# EAGLE board sensor_003 (EAGLE 7.3.0), part 1 of 2
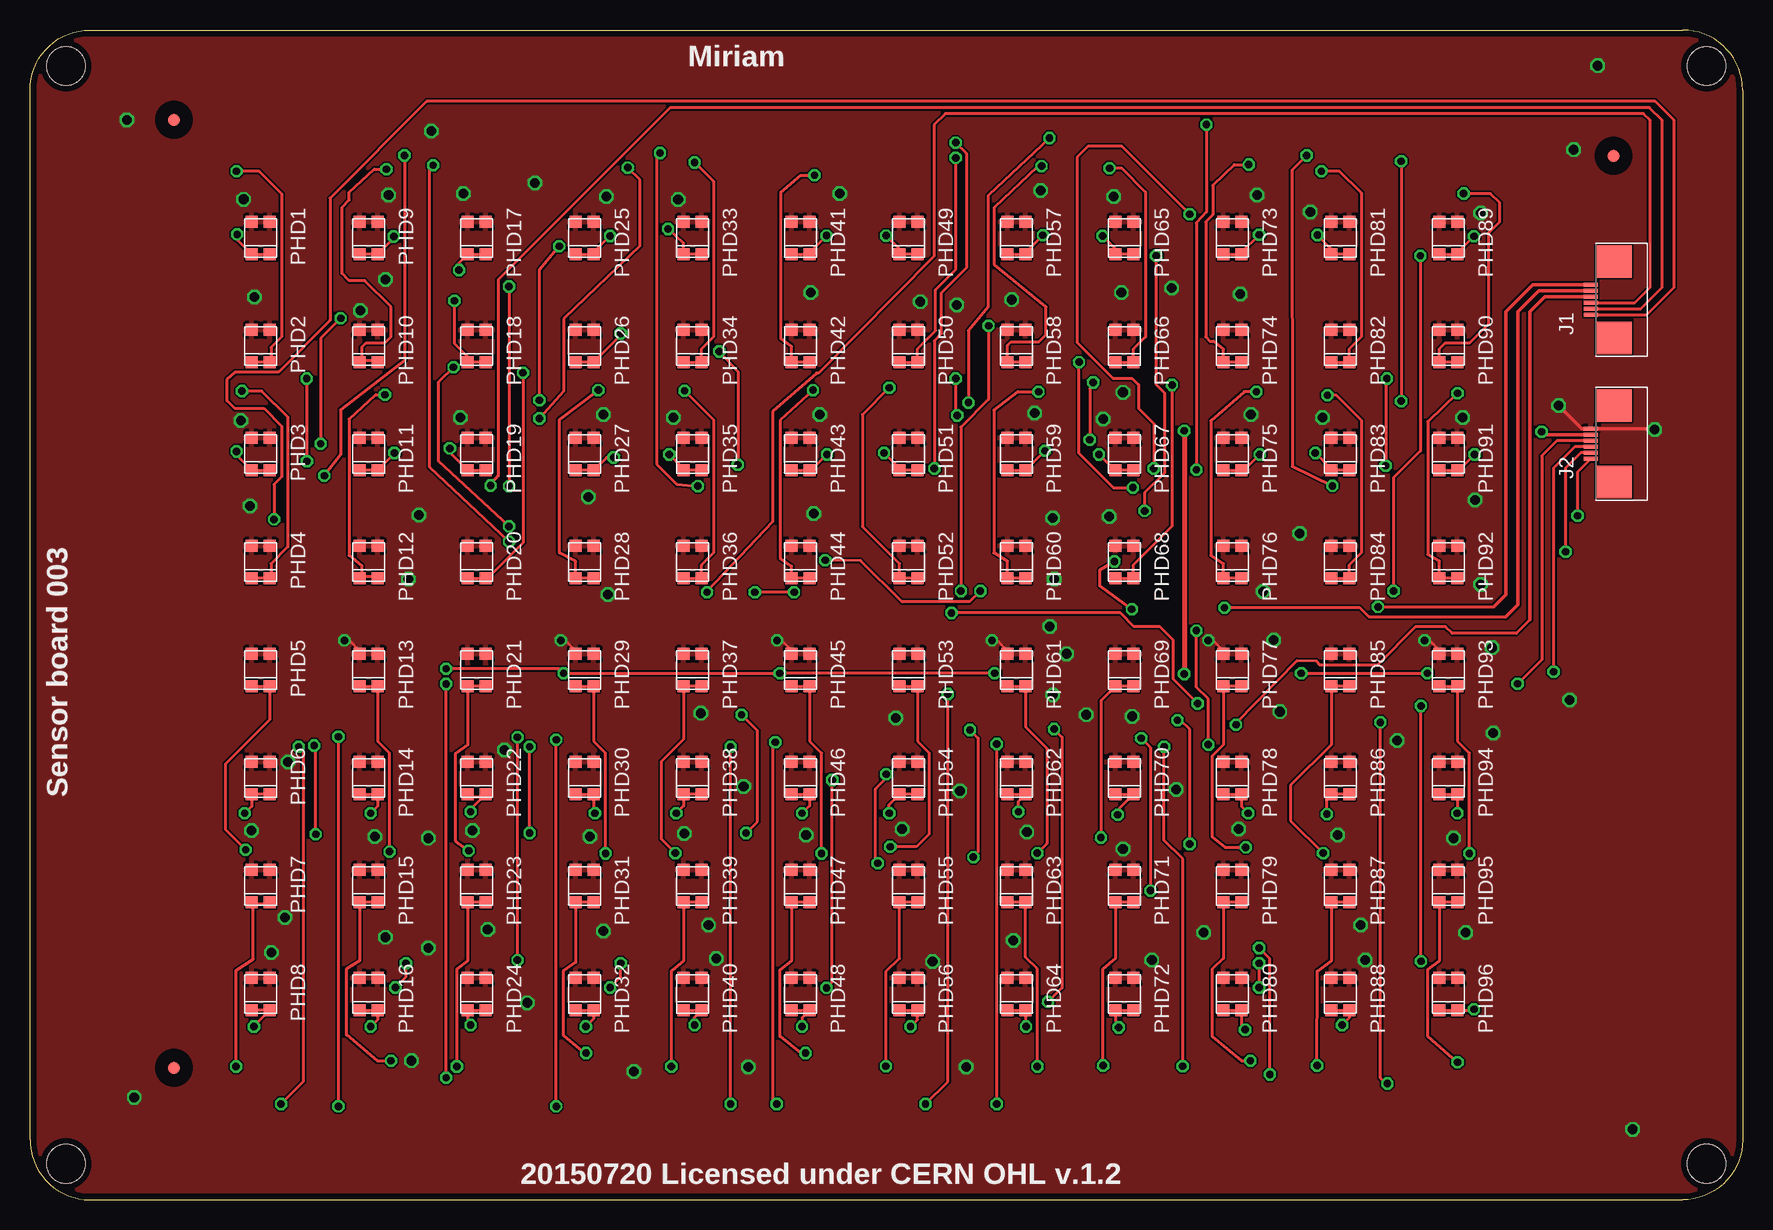
[diagram p5: board, top side]
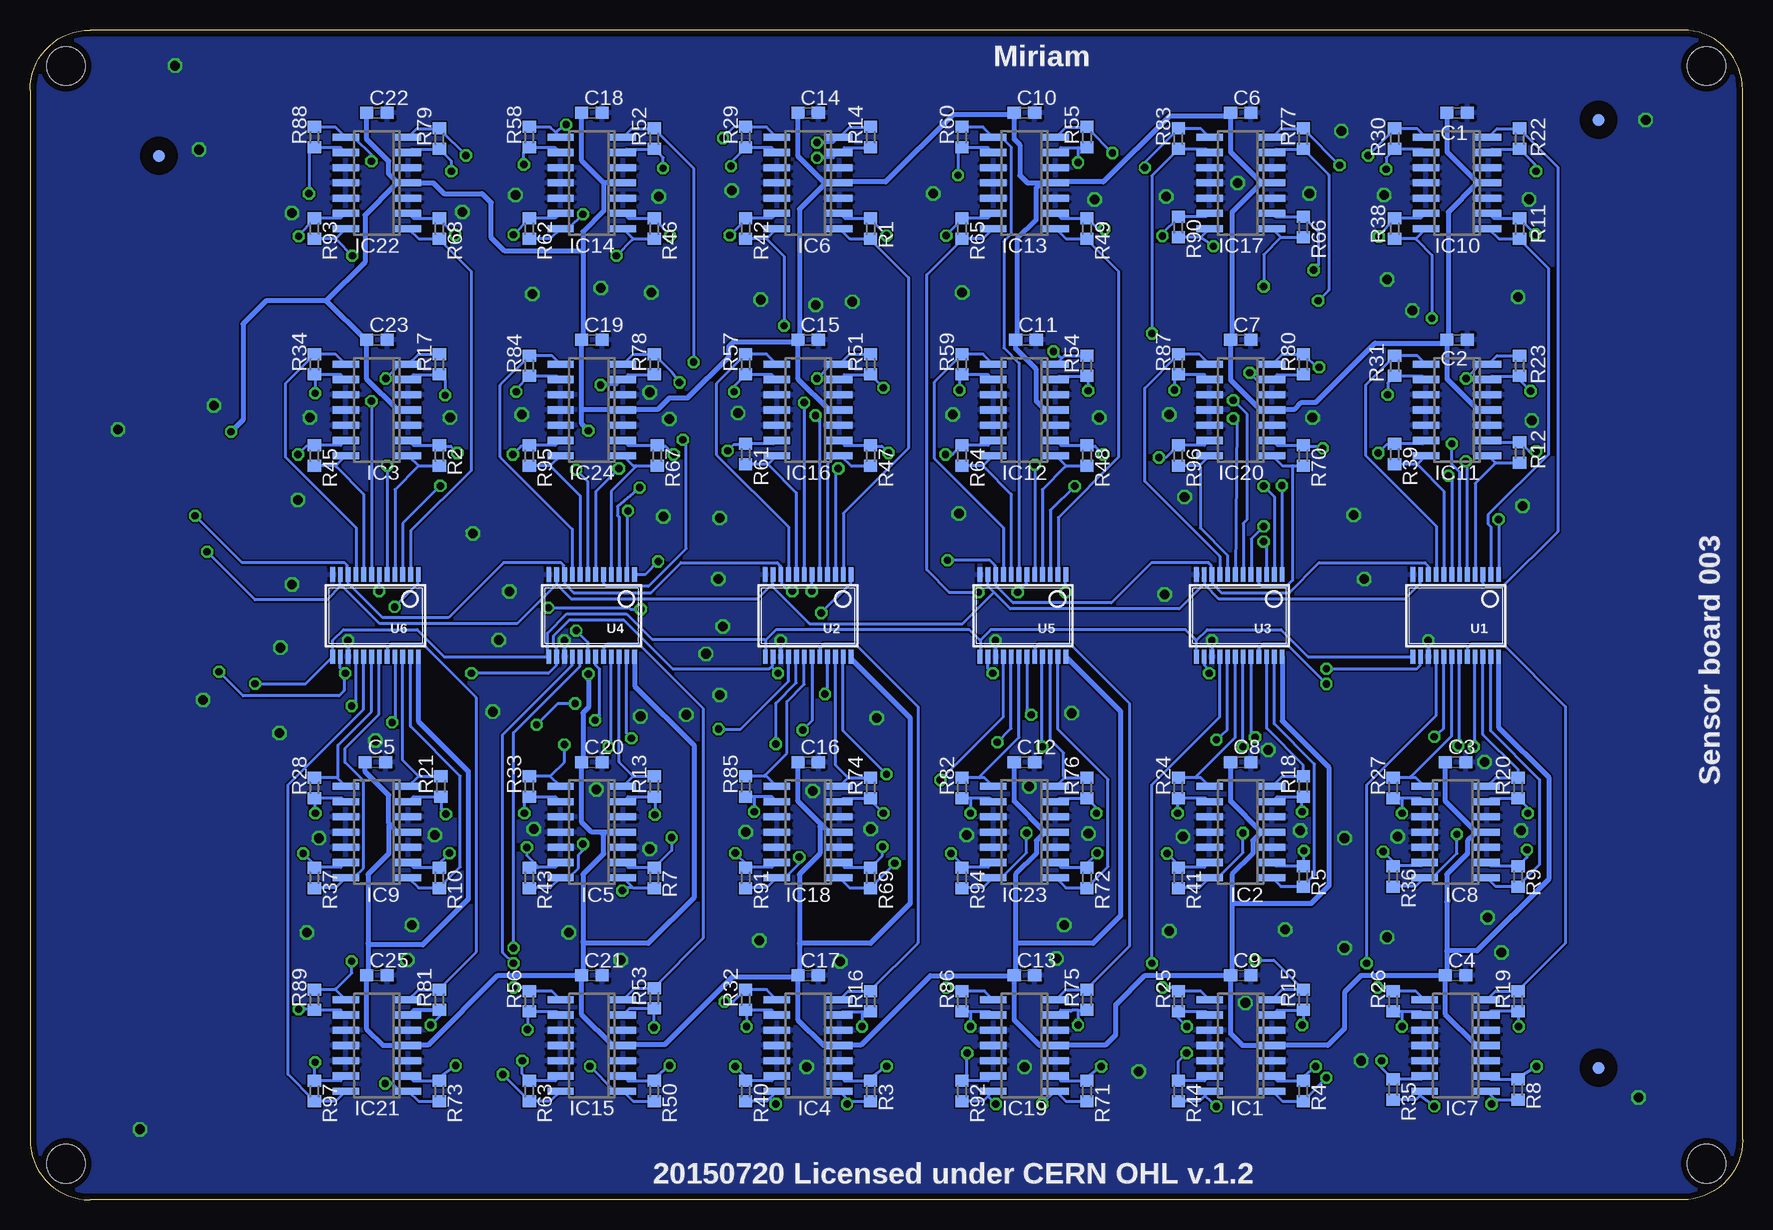
[diagram p6: board, bottom side, seen from below]

Size 142.76 x 97.48 mm. Coordinates in mm from the lower left corner, seen from the top.
Outline: 0,87.91 arc0 0,87.91
Outline: 5,0 137.76,0 arc90 142.76,5 142.76,92.48 arc90 137.76,97.48 5,97.48 arc90 0,92.48 0,5 arc90 5,0
Copper layers (1*16): Top 0.035mm / dielectric 1.5mm / Bottom 0.035mm
Design rules "default *": minimum track width 9mil, minimum drill 24mil, track to track 6mil, track to pad 6mil, pad to pad 6mil, via to via 6mil, smd to smd 6mil, copper to edge 20mil, drill to drill 8mil, minimum pad ring 10mil, minimum via ring 8mil, stop-mask expansion 4mil, vias tented up to drill 0mil, thermal gap 10mil
Net classes: 0 default: width 0.254 mm, drill 0.406 mm, clearance 0.127 mm; 1 power: width 0.406 mm, drill 0.406 mm, clearance 0.305 mm; 2 gnd: width 0.254 mm, drill 0.406 mm, clearance 0.254 mm; 3 power usb: width 0.254 mm, drill 0.406 mm, clearance 0.254 mm; 4 power12: width 1.778 mm, drill 0.889 mm, clearance 0.254 mm
Holes 3.2 mm at 3,94.48 139.76,94.48 139.76,3 3,3

## Footprints (pad centres in the part's own frame; a part is rotated, then mirrored left to right if it is on the bottom)
C0603 = smd 1.1 x 1: 1 -0.85,0; 2 0.85,0
FIDUCIA-MOUNT = smd 1.016 x 1.016: P$1 0,0
SO14 = smd 0.6 x 2.2: 1 -3.81,-2.6; 2 -2.54,-2.6; 3 -1.27,-2.6; 4 0,-2.6; 5 1.27,-2.6; 6 2.54,-2.6; 7 3.81,-2.6; 8 3.81,2.6; 9 2.54,2.6; 10 1.27,2.6; 11 0,2.6; 12 -1.27,2.6; 13 -2.54,2.6; 14 -3.81,2.6
68710614522 = smd 0.3 x 1.2: 1 -1.25,1.9; 2 -0.75,1.9; 3 -0.25,1.9; 4 0.25,1.9; 5 0.75,1.9; 6 1.25,1.9 | smd 2.7 x 3: Z1 -3.18,0; Z2 3.18,0
PD_0.2 = smd 1 x 1: 1 -1.25,0.6; 2 -1.25,-0.9; 3 1.45,0.6; 4 1.45,-0.9
R0603 = smd 1 x 1.1: 1 -0.85,0; 2 0.85,0
SSOP24 = smd 0.4 x 1.2: 1 -3.575,-3.42; 2 -2.925,-3.42; 3 -2.275,-3.42; 4 -1.625,-3.42; 5 -0.975,-3.42; 6 -0.325,-3.42; 7 0.325,-3.42; 8 0.975,-3.42; 9 1.625,-3.42; 10 2.275,-3.42; 11 2.925,-3.42; 12 3.575,-3.42; 13 3.575,3.42; 14 2.925,3.42; 15 2.275,3.42; 16 1.625,3.42; 17 0.975,3.42; 18 0.325,3.42; 19 -0.325,3.42; 20 -0.975,3.42; 21 -1.625,3.42; 22 -2.275,3.42; 23 -2.925,3.42; 24 -3.575,3.42

## Placement (x,y rotation side)
C1  100nF  [C0603]  23.8,90.58 0 bottom
C2  100nF  [C0603]  23.8,71.66 0 bottom
C3  100nF  [C0603]  23.92,36.48 0 bottom
C4  100nF  [C0603]  23.92,18.7 0 bottom
C5  100nF  [C0603]  113.97,36.48 0 bottom
C6  100nF  [C0603]  41.83,90.58 0 bottom
C7  100nF  [C0603]  41.83,71.66 0 bottom
C8  100nF  [C0603]  41.83,36.48 0 bottom
C9  100nF  [C0603]  41.83,18.7 0 bottom
C10  100nF  [C0603]  59.86,90.58 0 bottom
C11  100nF  [C0603]  59.74,71.66 0 bottom
C12  100nF  [C0603]  59.86,36.48 0 bottom
C13  100nF  [C0603]  59.86,18.7 0 bottom
C14  100nF  [C0603]  77.9,90.58 0 bottom
C15  100nF  [C0603]  77.9,71.66 0 bottom
C16  100nF  [C0603]  77.9,36.48 0 bottom
C17  100nF  [C0603]  77.9,18.7 0 bottom
C18  100nF  [C0603]  95.93,90.58 0 bottom
C19  100nF  [C0603]  95.93,71.66 0 bottom
C20  100nF  [C0603]  95.93,36.48 0 bottom
C21  100nF  [C0603]  95.93,18.7 0 bottom
C22  100nF  [C0603]  113.84,90.58 0 bottom
C23  100nF  [C0603]  113.84,71.66 0 bottom
C25  100nF  [C0603]  113.84,18.7 0 bottom
FD1  FIDUCIALMOUNT  [FIDUCIA-MOUNT]  12,90 0 top
FD2  FIDUCIALMOUNT  [FIDUCIA-MOUNT]  12,11 0 top
FD3  FIDUCIALMOUNT  [FIDUCIA-MOUNT]  132,87 0 top
FD4  FIDUCIALMOUNT  [FIDUCIA-MOUNT]  12,90 0 bottom
FD5  FIDUCIALMOUNT  [FIDUCIA-MOUNT]  12,11 0 bottom
FD6  FIDUCIALMOUNT  [FIDUCIA-MOUNT]  132,87 0 bottom
IC1  LMV324  [SO14]  41.83,12.86 90 bottom
IC2  LMV324  [SO14]  41.83,30.64 90 bottom
IC3  LMV324  [SO14]  113.84,65.82 90 bottom
IC4  LMV324  [SO14]  77.9,12.86 90 bottom
IC5  LMV324  [SO14]  95.93,30.64 90 bottom
IC6  LMV324  [SO14]  77.9,84.74 90 bottom
IC7  LMV324  [SO14]  23.92,12.86 90 bottom
IC8  LMV324  [SO14]  23.92,30.64 90 bottom
IC9  LMV324  [SO14]  113.84,30.64 90 bottom
IC10  LMV324  [SO14]  23.8,84.74 90 bottom
IC11  LMV324  [SO14]  23.8,65.82 90 bottom
IC12  LMV324  [SO14]  59.86,65.82 90 bottom
IC13  LMV324  [SO14]  59.86,84.74 90 bottom
IC14  LMV324  [SO14]  95.93,84.74 90 bottom
IC15  LMV324  [SO14]  95.93,12.86 90 bottom
IC16  LMV324  [SO14]  77.9,65.82 90 bottom
IC17  LMV324  [SO14]  41.83,84.74 90 bottom
IC18  LMV324  [SO14]  77.9,30.64 90 bottom
IC19  LMV324  [SO14]  59.86,12.86 90 bottom
IC20  LMV324  [SO14]  41.83,65.82 90 bottom
IC21  LMV324  [SO14]  113.84,12.86 90 bottom
IC22  LMV324  [SO14]  113.84,84.74 90 bottom
IC23  LMV324  [SO14]  59.86,30.64 90 bottom
IC24  LMV324  [SO14]  95.93,65.82 90 bottom
J1  [68710614522]  132,75 90 top
J2  [68710614522]  132,63 90 top
PHD1  CLS15-22C/L213G/TR8  [PD_0.2]  19.38,80.24 270 top
PHD2  CLS15-22C/L213G/TR8  [PD_0.2]  19.38,71.24 270 top
PHD3  CLS15-22C/L213G/TR8  [PD_0.2]  19.38,62.24 270 top
PHD4  CLS15-22C/L213G/TR8  [PD_0.2]  19.38,53.24 270 top
PHD5  CLS15-22C/L213G/TR8  [PD_0.2]  19.38,44.24 270 top
PHD6  CLS15-22C/L213G/TR8  [PD_0.2]  19.38,35.24 270 top
PHD7  CLS15-22C/L213G/TR8  [PD_0.2]  19.38,26.24 270 top
PHD8  CLS15-22C/L213G/TR8  [PD_0.2]  19.38,17.24 270 top
PHD9  CLS15-22C/L213G/TR8  [PD_0.2]  28.38,80.24 270 top
PHD10  CLS15-22C/L213G/TR8  [PD_0.2]  28.38,71.24 270 top
PHD11  CLS15-22C/L213G/TR8  [PD_0.2]  28.38,62.24 270 top
PHD12  CLS15-22C/L213G/TR8  [PD_0.2]  28.38,53.24 270 top
PHD13  CLS15-22C/L213G/TR8  [PD_0.2]  28.38,44.24 270 top
PHD14  CLS15-22C/L213G/TR8  [PD_0.2]  28.38,35.24 270 top
PHD15  CLS15-22C/L213G/TR8  [PD_0.2]  28.38,26.24 270 top
PHD16  CLS15-22C/L213G/TR8  [PD_0.2]  28.38,17.24 270 top
PHD17  CLS15-22C/L213G/TR8  [PD_0.2]  37.38,80.24 270 top
PHD18  CLS15-22C/L213G/TR8  [PD_0.2]  37.38,71.24 270 top
PHD19  CLS15-22C/L213G/TR8  [PD_0.2]  37.38,62.24 270 top
PHD20  CLS15-22C/L213G/TR8  [PD_0.2]  37.38,53.24 270 top
PHD21  CLS15-22C/L213G/TR8  [PD_0.2]  37.38,44.24 270 top
PHD22  CLS15-22C/L213G/TR8  [PD_0.2]  37.38,35.24 270 top
PHD23  CLS15-22C/L213G/TR8  [PD_0.2]  37.38,26.24 270 top
PHD24  CLS15-22C/L213G/TR8  [PD_0.2]  37.38,17.24 270 top
PHD25  CLS15-22C/L213G/TR8  [PD_0.2]  46.38,80.24 270 top
PHD26  CLS15-22C/L213G/TR8  [PD_0.2]  46.38,71.24 270 top
PHD27  CLS15-22C/L213G/TR8  [PD_0.2]  46.38,62.24 270 top
PHD28  CLS15-22C/L213G/TR8  [PD_0.2]  46.38,53.24 270 top
PHD29  CLS15-22C/L213G/TR8  [PD_0.2]  46.38,44.24 270 top
PHD30  CLS15-22C/L213G/TR8  [PD_0.2]  46.38,35.24 270 top
PHD31  CLS15-22C/L213G/TR8  [PD_0.2]  46.38,26.24 270 top
PHD32  CLS15-22C/L213G/TR8  [PD_0.2]  46.38,17.24 270 top
PHD33  CLS15-22C/L213G/TR8  [PD_0.2]  55.38,80.24 270 top
PHD34  CLS15-22C/L213G/TR8  [PD_0.2]  55.38,71.24 270 top
PHD35  CLS15-22C/L213G/TR8  [PD_0.2]  55.38,62.24 270 top
PHD36  CLS15-22C/L213G/TR8  [PD_0.2]  55.38,53.24 270 top
PHD37  CLS15-22C/L213G/TR8  [PD_0.2]  55.38,44.24 270 top
PHD38  CLS15-22C/L213G/TR8  [PD_0.2]  55.38,35.24 270 top
PHD39  CLS15-22C/L213G/TR8  [PD_0.2]  55.38,26.24 270 top
PHD40  CLS15-22C/L213G/TR8  [PD_0.2]  55.38,17.24 270 top
PHD41  CLS15-22C/L213G/TR8  [PD_0.2]  64.38,80.24 270 top
PHD42  CLS15-22C/L213G/TR8  [PD_0.2]  64.38,71.24 270 top
PHD43  CLS15-22C/L213G/TR8  [PD_0.2]  64.38,62.24 270 top
PHD44  CLS15-22C/L213G/TR8  [PD_0.2]  64.38,53.24 270 top
PHD45  CLS15-22C/L213G/TR8  [PD_0.2]  64.38,44.24 270 top
PHD46  CLS15-22C/L213G/TR8  [PD_0.2]  64.38,35.24 270 top
PHD47  CLS15-22C/L213G/TR8  [PD_0.2]  64.38,26.24 270 top
PHD48  CLS15-22C/L213G/TR8  [PD_0.2]  64.38,17.24 270 top
PHD49  CLS15-22C/L213G/TR8  [PD_0.2]  73.38,80.24 270 top
PHD50  CLS15-22C/L213G/TR8  [PD_0.2]  73.38,71.24 270 top
PHD51  CLS15-22C/L213G/TR8  [PD_0.2]  73.38,62.24 270 top
PHD52  CLS15-22C/L213G/TR8  [PD_0.2]  73.38,53.24 270 top
PHD53  CLS15-22C/L213G/TR8  [PD_0.2]  73.38,44.24 270 top
PHD54  CLS15-22C/L213G/TR8  [PD_0.2]  73.38,35.24 270 top
PHD55  CLS15-22C/L213G/TR8  [PD_0.2]  73.38,26.24 270 top
PHD56  CLS15-22C/L213G/TR8  [PD_0.2]  73.38,17.24 270 top
PHD57  CLS15-22C/L213G/TR8  [PD_0.2]  82.38,80.24 270 top
PHD58  CLS15-22C/L213G/TR8  [PD_0.2]  82.38,71.24 270 top
PHD59  CLS15-22C/L213G/TR8  [PD_0.2]  82.38,62.24 270 top
PHD60  CLS15-22C/L213G/TR8  [PD_0.2]  82.38,53.24 270 top
PHD61  CLS15-22C/L213G/TR8  [PD_0.2]  82.38,44.24 270 top
PHD62  CLS15-22C/L213G/TR8  [PD_0.2]  82.38,35.24 270 top
PHD63  CLS15-22C/L213G/TR8  [PD_0.2]  82.38,26.24 270 top
PHD64  CLS15-22C/L213G/TR8  [PD_0.2]  82.38,17.24 270 top
PHD65  CLS15-22C/L213G/TR8  [PD_0.2]  91.38,80.24 270 top
PHD66  CLS15-22C/L213G/TR8  [PD_0.2]  91.38,71.24 270 top
PHD67  CLS15-22C/L213G/TR8  [PD_0.2]  91.38,62.24 270 top
PHD68  CLS15-22C/L213G/TR8  [PD_0.2]  91.38,53.24 270 top
PHD69  CLS15-22C/L213G/TR8  [PD_0.2]  91.38,44.24 270 top
PHD70  CLS15-22C/L213G/TR8  [PD_0.2]  91.38,35.24 270 top
PHD71  CLS15-22C/L213G/TR8  [PD_0.2]  91.38,26.24 270 top
PHD72  CLS15-22C/L213G/TR8  [PD_0.2]  91.38,17.24 270 top
PHD73  CLS15-22C/L213G/TR8  [PD_0.2]  100.38,80.24 270 top
PHD74  CLS15-22C/L213G/TR8  [PD_0.2]  100.38,71.24 270 top
PHD75  CLS15-22C/L213G/TR8  [PD_0.2]  100.38,62.24 270 top
PHD76  CLS15-22C/L213G/TR8  [PD_0.2]  100.38,53.24 270 top
PHD77  CLS15-22C/L213G/TR8  [PD_0.2]  100.38,44.24 270 top
PHD78  CLS15-22C/L213G/TR8  [PD_0.2]  100.38,35.24 270 top
PHD79  CLS15-22C/L213G/TR8  [PD_0.2]  100.38,26.24 270 top
PHD80  CLS15-22C/L213G/TR8  [PD_0.2]  100.38,17.24 270 top
PHD81  CLS15-22C/L213G/TR8  [PD_0.2]  109.38,80.24 270 top
PHD82  CLS15-22C/L213G/TR8  [PD_0.2]  109.38,71.24 270 top
PHD83  CLS15-22C/L213G/TR8  [PD_0.2]  109.38,62.24 270 top
PHD84  CLS15-22C/L213G/TR8  [PD_0.2]  109.38,53.24 270 top
PHD85  CLS15-22C/L213G/TR8  [PD_0.2]  109.38,44.24 270 top
PHD86  CLS15-22C/L213G/TR8  [PD_0.2]  109.38,35.24 270 top
PHD87  CLS15-22C/L213G/TR8  [PD_0.2]  109.38,26.24 270 top
PHD88  CLS15-22C/L213G/TR8  [PD_0.2]  109.38,17.24 270 top
PHD89  CLS15-22C/L213G/TR8  [PD_0.2]  118.38,80.24 270 top
PHD90  CLS15-22C/L213G/TR8  [PD_0.2]  118.38,71.24 270 top
PHD91  CLS15-22C/L213G/TR8  [PD_0.2]  118.38,62.24 270 top
PHD92  CLS15-22C/L213G/TR8  [PD_0.2]  118.38,53.24 270 top
PHD93  CLS15-22C/L213G/TR8  [PD_0.2]  118.38,44.24 270 top
PHD94  CLS15-22C/L213G/TR8  [PD_0.2]  118.38,35.24 270 top
PHD95  CLS15-22C/L213G/TR8  [PD_0.2]  118.38,26.24 270 top
PHD96  CLS15-22C/L213G/TR8  [PD_0.2]  118.38,17.24 270 top
R1  3.9Mohm  [R0603]  72.69,80.93 270 bottom
R2  3.9Mohm  [R0603]  108.63,62.01 270 bottom
R3  3.9Mohm  [R0603]  72.69,9.05 270 bottom
R4  3.9Mohm  [R0603]  36.62,9.05 270 bottom
R5  3.9Mohm  [R0603]  36.62,26.95 270 bottom
R7  3.9Mohm  [R0603]  90.73,26.83 270 bottom
R8  3.9Mohm  [R0603]  18.72,9.18 270 bottom
R9  3.9Mohm  [R0603]  18.72,26.95 270 bottom
R10  3.9Mohm  [R0603]  108.63,26.83 270 bottom
R11  3.9Mohm  [R0603]  18.59,80.93 270 bottom
R12  3.9Mohm  [R0603]  18.59,62.26 270 bottom
R13  3.9Mohm  [R0603]  90.73,34.45 90 bottom
R14  3.9Mohm  [R0603]  72.69,88.55 90 bottom
R15  3.9Mohm  [R0603]  36.62,16.67 90 bottom
R16  3.9Mohm  [R0603]  72.69,16.54 90 bottom
R17  3.9Mohm  [R0603]  108.63,69.63 90 bottom
R18  3.9Mohm  [R0603]  36.62,34.45 90 bottom
R19  3.9Mohm  [R0603]  18.72,16.54 90 bottom
R20  3.9Mohm  [R0603]  18.72,34.32 90 bottom
R21  3.9Mohm  [R0603]  108.51,34.45 90 bottom
R22  3.9Mohm  [R0603]  18.59,88.42 90 bottom
R23  3.9Mohm  [R0603]  18.59,69.5 90 bottom
R24  3.9Mohm  [R0603]  47.04,34.32 90 bottom
R25  3.9Mohm  [R0603]  47.04,16.54 90 bottom
R26  3.9Mohm  [R0603]  29.13,16.54 90 bottom
R27  3.9Mohm  [R0603]  29.13,34.32 90 bottom
R28  3.9Mohm  [R0603]  119.05,34.32 90 bottom
R29  3.9Mohm  [R0603]  83.11,88.55 90 bottom
R30  3.9Mohm  [R0603]  29,88.42 90 bottom
R31  3.9Mohm  [R0603]  29,69.5 90 bottom
R32  3.9Mohm  [R0603]  83.11,16.67 90 bottom
R33  3.9Mohm  [R0603]  101.14,34.45 90 bottom
R34  3.9Mohm  [R0603]  119.05,69.63 90 bottom
R35  3.9Mohm  [R0603]  29.13,9.18 270 bottom
R36  3.9Mohm  [R0603]  29.13,26.95 270 bottom
R37  3.9Mohm  [R0603]  119.05,26.83 270 bottom
R38  3.9Mohm  [R0603]  29,80.93 270 bottom
R39  3.9Mohm  [R0603]  29,62.13 270 bottom
R40  3.9Mohm  [R0603]  83.11,9.05 270 bottom
R41  3.9Mohm  [R0603]  47.04,26.83 270 bottom
R42  3.9Mohm  [R0603]  83.11,80.93 270 bottom
R43  3.9Mohm  [R0603]  101.14,26.83 270 bottom
R44  3.9Mohm  [R0603]  47.04,9.05 270 bottom
R45  3.9Mohm  [R0603]  119.05,62.01 270 bottom
R46  3.9Mohm  [R0603]  90.73,80.93 270 bottom
R47  3.9Mohm  [R0603]  72.69,62.01 270 bottom
R48  3.9Mohm  [R0603]  54.66,62.01 270 bottom
R49  3.9Mohm  [R0603]  54.66,80.93 270 bottom
R50  3.9Mohm  [R0603]  90.73,9.05 270 bottom
R51  3.9Mohm  [R0603]  72.69,69.63 90 bottom
R52  3.9Mohm  [R0603]  90.73,88.42 90 bottom
R53  3.9Mohm  [R0603]  90.73,16.8 90 bottom
R54  3.9Mohm  [R0603]  54.66,69.5 90 bottom
R55  3.9Mohm  [R0603]  54.66,88.55 90 bottom
R56  3.9Mohm  [R0603]  101.14,16.54 90 bottom
R57  3.9Mohm  [R0603]  83.11,69.63 90 bottom
R58  3.9Mohm  [R0603]  101.14,88.55 90 bottom
R59  3.9Mohm  [R0603]  65.07,69.63 90 bottom
R60  3.9Mohm  [R0603]  65.07,88.55 90 bottom
R61  3.9Mohm  [R0603]  83.11,62.13 270 bottom
R62  3.9Mohm  [R0603]  101.14,80.93 270 bottom
R63  3.9Mohm  [R0603]  101.14,9.05 270 bottom
R64  3.9Mohm  [R0603]  65.07,62.01 270 bottom
R65  3.9Mohm  [R0603]  65.07,80.93 270 bottom
R66  3.9Mohm  [R0603]  36.62,81.06 270 bottom
R67  3.9Mohm  [R0603]  90.47,62.01 270 bottom
R68  3.9Mohm  [R0603]  108.63,80.93 270 bottom
R69  3.9Mohm  [R0603]  72.69,26.83 270 bottom
R70  3.9Mohm  [R0603]  36.62,62.01 270 bottom
R71  3.9Mohm  [R0603]  54.66,9.05 270 bottom
R72  3.9Mohm  [R0603]  54.66,26.83 270 bottom
R73  3.9Mohm  [R0603]  108.63,9.05 270 bottom
R74  3.9Mohm  [R0603]  72.69,34.32 90 bottom
R75  3.9Mohm  [R0603]  54.66,16.67 90 bottom
R76  3.9Mohm  [R0603]  54.66,34.32 90 bottom
R77  3.9Mohm  [R0603]  36.62,88.42 90 bottom
R78  3.9Mohm  [R0603]  90.73,69.63 90 bottom
R79  3.9Mohm  [R0603]  108.63,88.42 90 bottom
R80  3.9Mohm  [R0603]  36.62,69.63 90 bottom
R81  3.9Mohm  [R0603]  108.63,16.67 90 bottom
R82  3.9Mohm  [R0603]  65.07,34.32 90 bottom
R83  3.9Mohm  [R0603]  47.04,88.42 90 bottom
R84  3.9Mohm  [R0603]  101.14,69.5 90 bottom
R85  3.9Mohm  [R0603]  83.11,34.45 90 bottom
R86  3.9Mohm  [R0603]  65.07,16.54 90 bottom
R87  3.9Mohm  [R0603]  47.04,69.63 90 bottom
R88  3.9Mohm  [R0603]  119.05,88.55 90 bottom
R89  3.9Mohm  [R0603]  119.05,16.67 90 bottom
R90  3.9Mohm  [R0603]  47.04,81.06 270 bottom
R91  3.9Mohm  [R0603]  83.11,26.83 270 bottom
R92  3.9Mohm  [R0603]  65.07,9.05 270 bottom
R93  3.9Mohm  [R0603]  119.05,80.93 270 bottom
R94  3.9Mohm  [R0603]  65.07,26.83 270 bottom
R95  3.9Mohm  [R0603]  101.14,62.01 270 bottom
R96  3.9Mohm  [R0603]  47.04,62.01 270 bottom
R97  3.9Mohm  [R0603]  119.05,9.05 270 bottom
U1  74HC4067  [SSOP24]  23.92,48.67 180 bottom
U2  74HC4067  [SSOP24]  77.9,48.67 180 bottom
U3  74HC4067  [SSOP24]  41.96,48.67 180 bottom
U4  74HC4067  [SSOP24]  95.93,48.67 180 bottom
U5  74HC4067  [SSOP24]  59.99,48.67 180 bottom
U6  74HC4067  [SSOP24]  113.97,48.67 180 bottom